# Altium schematic sheet 50_VOLTAGE_FRONTEND.SchDoc
size A; SheetNumber: 7; SheetTotal: 7
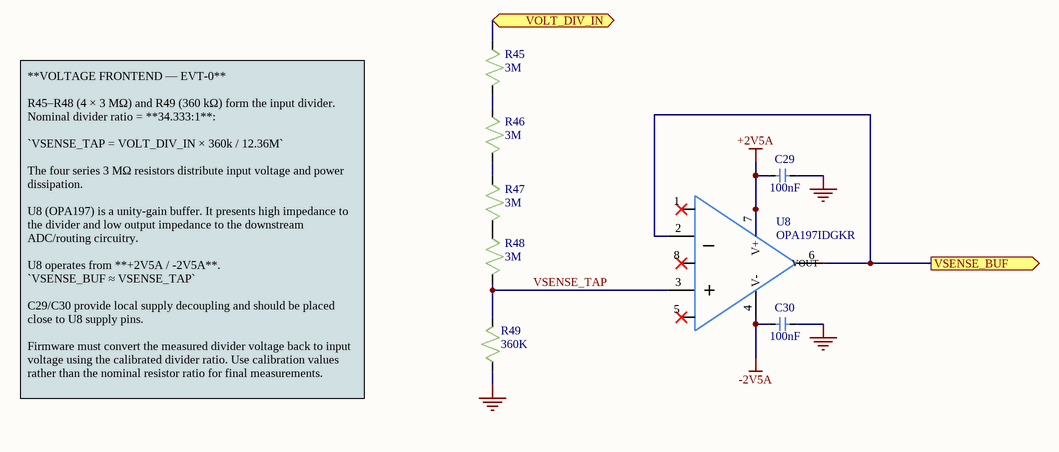
[diagram p0: 50_VOLTAGE_FRONTEND.SchDoc]

## Parts
C29  100nF  [C0805]
C30  100nF  [C0805]
R45  3M  [R1206]
R46  3M  [R1206]
R47  3M  [R1206]
R48  3M  [R1206]
R49  360K  [R1206]
U8  OPA197IDGKR  [OPA197IDGKR]

## Ports
VOLT_DIV_IN (bidir, see 00_SYSTEM_TOP[3C], 40_INPUT_ROUTING[2B]), VSENSE_BUF (out, see 00_SYSTEM_TOP[3C], 30_ADC[2C])

## Nets
+2V5A: C29.1 U8.7(V+)
-2V5A: C30.1 U8.4(V-)
GND: C29.2 C30.2 R49.1
VOLT_DIV_IN: R45.1 ; port VOLT_DIV_IN
VSENSE_BUF: U8.2(_) U8.6(VOUT) ; port VSENSE_BUF
VSENSE_TAP: R48.2 R49.2 U8.3(+)
NetR45_2: R45.2 R46.1
NetR46_2: R46.2 R47.1
NetR47_2: R47.2 R48.1

Not connected (* = marked no-connect by the designer): U8 1* 5* 8*

## Notes on the sheet
- **VOLTAGE FRONTEND — EVT-0**
  R45–R48 (4 × 3 MΩ) and R49 (360 kΩ) form the input divider.
  Nominal divider ratio = **34.333:1**:
  `VSENSE_TAP = VOLT_DIV_IN × 360k / 12.36M`
  The four series 3 MΩ resistors distribute input voltage and power dissipation.
  U8 (OPA197) is a unity-gain buffer. It presents high impedance to the divider and low output impedance to the downstream ADC/routing circuitry.
  U8 operates from **+2V5A / -2V5A**.
  `VSENSE_BUF ≈ VSENSE_TAP`
  C29/C30 provide local supply decoupling and should be placed close to U8 supply pins.
  Firmware must convert the measured divider voltage back to input voltage using the calibrated divider ratio. Use calibration values rather than the nominal resistor ratio for final measurements.

## Library data of the parts
C29 C30 = C_0805
R45-R48 = RGV3216P-3004-B-T1: RES 3M OHM 0.1% 1/4W 1206; Manufacturer: Susumu; Power Rating: 250mW; Value: 3MΩ; Temperature Coefficient: 25ppm/°C; Working Voltage: 700V; Supplier: DigiKey; Supplier Part Number: 408-RGV3216P-3004-B-T1CT-ND; Manufacturer Part Number: RGV3216P-3004-B-T1; RoHS: Compliant; Category: Chip SMD Resistors; Stock: 5108; Pricing: 1=0.4, 10=0.332, 50=0.291, 100=0.2751, 500=0.243 (USD); Case/Package: 1206; Composition: Thin Film; Height: 400µm; Length: 3.2mm; Lifecycle Status: Production; Max Operating Temperature: 155°C; Min Operating Temperature: -55°C; Mounting Technology: Surface Mount; Number of Terminals: 2; Ratings: AEC-Q200; REACH SVHC: Yes; Tolerance: 0.1%; Width: 1.6mm; ComponentLink1URL: https://datasheet.octopart.com:443/RGV3216P-3004-B-T1-Susumu-datasheet-182148317.pdf?src-supplier=IHS; ComponentLink1Description: https://datasheet.octopart.com:443/RGV3216P-3004-B-T1-Susumu-datasheet-182148317.pdf?src-supplier=IHS
R49 = RGV3216P-3603-B-T1: RES 360K OHM 0.1% 1/4W 1206; Manufacturer: Susumu; Power Rating: 250mW; Value: 360kΩ; Temperature Coefficient: 25ppm/°C; Working Voltage: 700V; Supplier: DigiKey; Supplier Part Number: 408-RGV3216P-3603-B-T1CT-ND; Manufacturer Part Number: RGV3216P-3603-B-T1; RoHS: Compliant; Category: Chip SMD Resistors; Stock: 572; Pricing: 1=0.38, 10=0.313, 50=0.2746, 100=0.2595, 500=0.22926 (USD); Case/Package: 1206; Composition: Thin Film; Export Control Classification Number (ECCN) Code: EAR99; Height: 400µm; Harmonized Tariff Schedule (HTS) Code: 8533.21.00.30; Introduction Date: 2020-06-08; Length: 3.2mm; Lifecycle Status: Production; Max Operating Temperature: 155°C; Min Operating Temperature: -55°C; Mounting Technology: Surface Mount; Number of Terminals: 2; Ratings: AEC-Q200; REACH SVHC: Yes; Tolerance: 0.1%; Width: 1.6mm; ComponentLink1URL: https://datasheet.octopart.com:443/RGV3216P-3603-B-T1-Susumu-datasheet-182148317.pdf?src-supplier=IHS; ComponentLink1Description: https://datasheet.octopart.com:443/RGV3216P-3603-B-T1-Susumu-datasheet-182148317.pdf?src-supplier=IHS
U8 = OPA197IDGKR: Precision rail-to-rail operational amplifier; Manufacturer: Texas Instruments; Manufacturer Lifecycle Status: ACTIVE; Bandwidth: 10MHz; Input Bias Current: 5pA; Input Offset Voltage (Vos): 25µV; Number of Amplifiers: 1; Operating Supply Current: 1mA; Output Current per Channel: 65mA; Slew Rate: 20V/µs; Supplier: DigiKey; Supplier Part Number: 296-44205-1-ND; Manufacturer Part Number: OPA197IDGKR; RoHS: Compliant; Category: Amplifiers - Op Amps, Buffer, Instrumentation; Stock: 2306; Pricing: 1=2.1, 10=1.548, 25=1.4112, 100=1.2599, 250=1.18784, 500=1.1475 (USD); Case/Package: VSSOP; Gain Bandwidth Product: 10MHz; Height: 0m; Lead Free: Lead Free; Length: 3mm; Lifecycle Status: Production; Max Operating Temperature: 125°C; Min Operating Temperature: -40°C; Mounting Technology: Surface Mount; Number of Channels: 1; Number of Circuits: 1; Pins: 8; Packaging: Cut Tape; REACH SVHC: No; Schedule B: 8542330000; Thickness: 970µm; Width: 3mm; ComponentLink1URL: https://sigma.octopart.com:443/178522223/technical_drawing/Texas-Instruments-OPA197IDGKR.pdf?src-supplier=Texas+Instruments; ComponentLink1Description: https://sigma.octopart.com:443/178522223/technical_drawing/Texas-Instruments-OPA197IDGKR.pdf?src-supplier=Texas+Instruments; ComponentLink2URL: https://octopart.com:443/opatz8j6/c1?t=FOH0RitQzD0XlKnT_NgRAgueVSVogVIH0_VtQKvX5g7tSbiKJHTY1QoPj-fRZWmhrDdG3-oaeD6KdjkigGqv_J-kshTw3jN_-Wt-WPxaVrD8pn1GPjwVJZnq1bl9XjIvoPWB7ZeLkdoepKv730yRgLbkP6aQFYp2DXOoQZirO_tZyNijjj9IWQhNZ18j4ImlA22DVwSTOFbSObjO7PzHae2dQ8oh_w5MV0QKndgc48Q4_peIBbvSJ5ut7KrVy2MbvjxsXzd0WmA-PvDo_y8MleauDzvSfGCoV1tfcR96dhtUS7VWbLwUJ1LuFIJRQw7vaioM7VjuujX3Pxl55TpYA49bpJc_AW7jaO84eqgHL_99ZB-Z4JMV0rb-u9axked6zFdf0Q&src-supplier=Texas+Instruments; ComponentLink2Description: https://octopart.com:443/opatz8j6/c1?t=FOH0RitQzD0XlKnT_NgRAgueVSVogVIH0_VtQKvX5g7tSbiKJHTY1QoPj-fRZWmhrDdG3-oaeD6KdjkigGqv_J-kshTw3jN_-Wt-WPxaVrD8pn1GPjwVJZnq1bl9XjIvoPWB7ZeLkdoepKv730yRgLbkP6aQFYp2DXOoQZirO_tZyNijjj9IWQhNZ18j4ImlA22DVwSTOFbSObjO7PzHae2dQ8oh_w5MV0QKndgc48Q4_peIBbvSJ5ut7KrVy2MbvjxsXzd0WmA-PvDo_y8MleauDzvSfGCoV1tfcR96dhtUS7VWbLwUJ1LuFIJRQw7vaioM7VjuujX3Pxl55TpYA49bpJc_AW7jaO84eqgHL_99ZB-Z4JMV0rb-u9axked6zFdf0Q&src-supplier=Texas+Instruments; ComponentLink3URL: https://datasheet.octopart.com:443/OPA197IDGKR-Texas-Instruments-datasheet-62062805.pdf?src-supplier=Texas+Instruments; ComponentLink3Description: https://datasheet.octopart.com:443/OPA197IDGKR-Texas-Instruments-datasheet-62062805.pdf?src-supplier=Texas+Instruments; ComponentLink4URL: https://sigma.octopart.com:443/49250154/technical_drawing/Texas-Instruments-OPA197IDGKR.pdf?src-supplier=Texas+Instruments; ComponentLink4Description: https://sigma.octopart.com:443/49250154/technical_drawing/Texas-Instruments-OPA197IDGKR.pdf?src-supplier=Texas+Instruments; ComponentLink5URL: https://datasheet.octopart.com:443/OPA197IDGKR-Texas-Instruments-datasheet-65713346.pdf?src-supplier=Newark; ComponentLink5Description: https://datasheet.octopart.com:443/OPA197IDGKR-Texas-Instruments-datasheet-65713346.pdf?src-supplier=Newark; ComponentLink6URL: https://datasheet.octopart.com:443/OPA197IDGKR-Texas-Instruments-datasheet-62333749.pdf?src-supplier=element14+APAC; ComponentLink6Description: https://datasheet.octopart.com:443/OPA197IDGKR-Texas-Instruments-datasheet-62333749.pdf?src-supplier=element14+APAC; ComponentLink7URL: https://datasheet.octopart.com:443/OPA197IDGKR-Texas-Instruments-datasheet-164361763.pdf?src-supplier=SHENGYU+ELECTRONICS; ComponentLink7Description: https://datasheet.octopart.com:443/OPA197IDGKR-Texas-Instruments-datasheet-164361763.pdf?src-supplier=SHENGYU+ELECTRONICS; ComponentLink8URL: https://datasheet.octopart.com:443/OPA197IDGKR-Texas-Instruments-datasheet-100480384.pdf?src-supplier=HQonline; ComponentLink8Description: https://datasheet.octopart.com:443/OPA197IDGKR-Texas-Instruments-datasheet-100480384.pdf?src-supplier=HQonline; ComponentLink9URL: https://datasheet.octopart.com:443/OPA197IDGKR-Texas-Instruments-datasheet-140571582.pdf?src-supplier=Arrow.cn; ComponentLink9Description: https://datasheet.octopart.com:443/OPA197IDGKR-Texas-Instruments-datasheet-140571582.pdf?src-supplier=Arrow.cn; ComponentLink10URL: http://sigma.octopart.com:80/reach_statement/Texas-Instruments-company-64.pdf?src-supplier=Compliance+Statements; ComponentLink10Description: http://sigma.octopart.com:80/reach_statement/Texas-Instruments-company-64.pdf?src-supplier=Compliance+Statements; ComponentLink11URL: http://sigma.octopart.com:80/conflict_mineral_statement/Texas-Instruments-company-63.pdf?src-supplier=Compliance+Statements; ComponentLink11Description: http://sigma.octopart.com:80/conflict_mineral_statement/Texas-Instruments-company-63.pdf?src-supplier=Compliance+Statements